# EAGLE design roast-pcb (EAGLE 9.1.3)
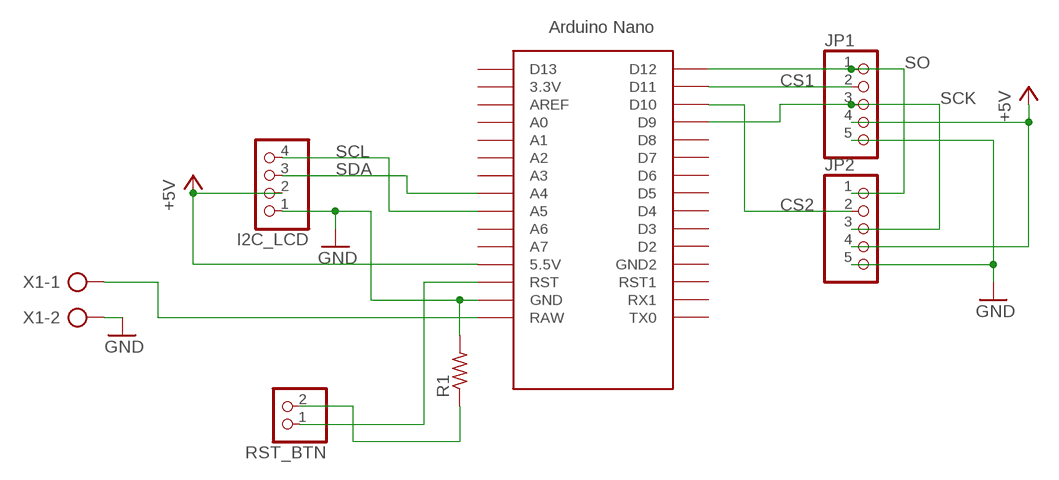
[diagram p0: schematic, sheet 1]

## Parts
I2C_LCD  PINHD-1X4  [1X04]
JP1  PINHD-1X5  [1X05]
JP2  PINHD-1X5  [1X05]
R1  R-US_0207/10  [0207/10]
RST_BTN  PINHD-1X2  [1X02]
U$1  NANO  [NANO]
X1  AK300/2  [AK300/2]

## Nets
+5V: I2C_LCD.2 JP1.4 JP2.4 U$1.5V(5.5V)
CS1: JP1.2 U$1.D11
CS2: JP2.2 U$1.D10
GND: I2C_LCD.1 JP1.5 JP2.5 R1.2 U$1.GND X1.2
N$1: RST_BTN.1 U$1.RST
N$4: U$1.RAW X1.1
N$5: R1.1 RST_BTN.2
SCK: JP1.3 JP2.3 U$1.D9
SCL: I2C_LCD.4 U$1.A5
SDA: I2C_LCD.3 U$1.A4
SO: JP1.1 JP2.1 U$1.D12
Unconnected: U$1.3.3V U$1.A0 U$1.A1 U$1.A2 U$1.A3 U$1.A6 U$1.A7 U$1.AREF U$1.D2 U$1.D3 U$1.D4 U$1.D5 U$1.D6 U$1.D7 U$1.D8 U$1.D13 U$1.GND1(GND2) U$1.ICSP1 U$1.ICSP2 U$1.ICSP3 U$1.ICSP4 U$1.ICSP5 U$1.ICSP6 U$1.RST1 U$1.RX1 U$1.TX0

## Library data of the parts
I2C_LCD = pinhead:PINHD-1X4: PIN HEADER
JP1 JP2 = pinhead:PINHD-1X5: PIN HEADER
R1 = rcl:R-US_: RESISTOR, American symbol; SPICEPREFIX: R
RST_BTN = pinhead:PINHD-1X2: PIN HEADER
U$1 = Arduino-clone:NANO: Arduino Nano
X1 = con-ptr500:AK300/2: CONNECTOR; OC_FARNELL: unknown; OC_NEWARK: unknown

## Board
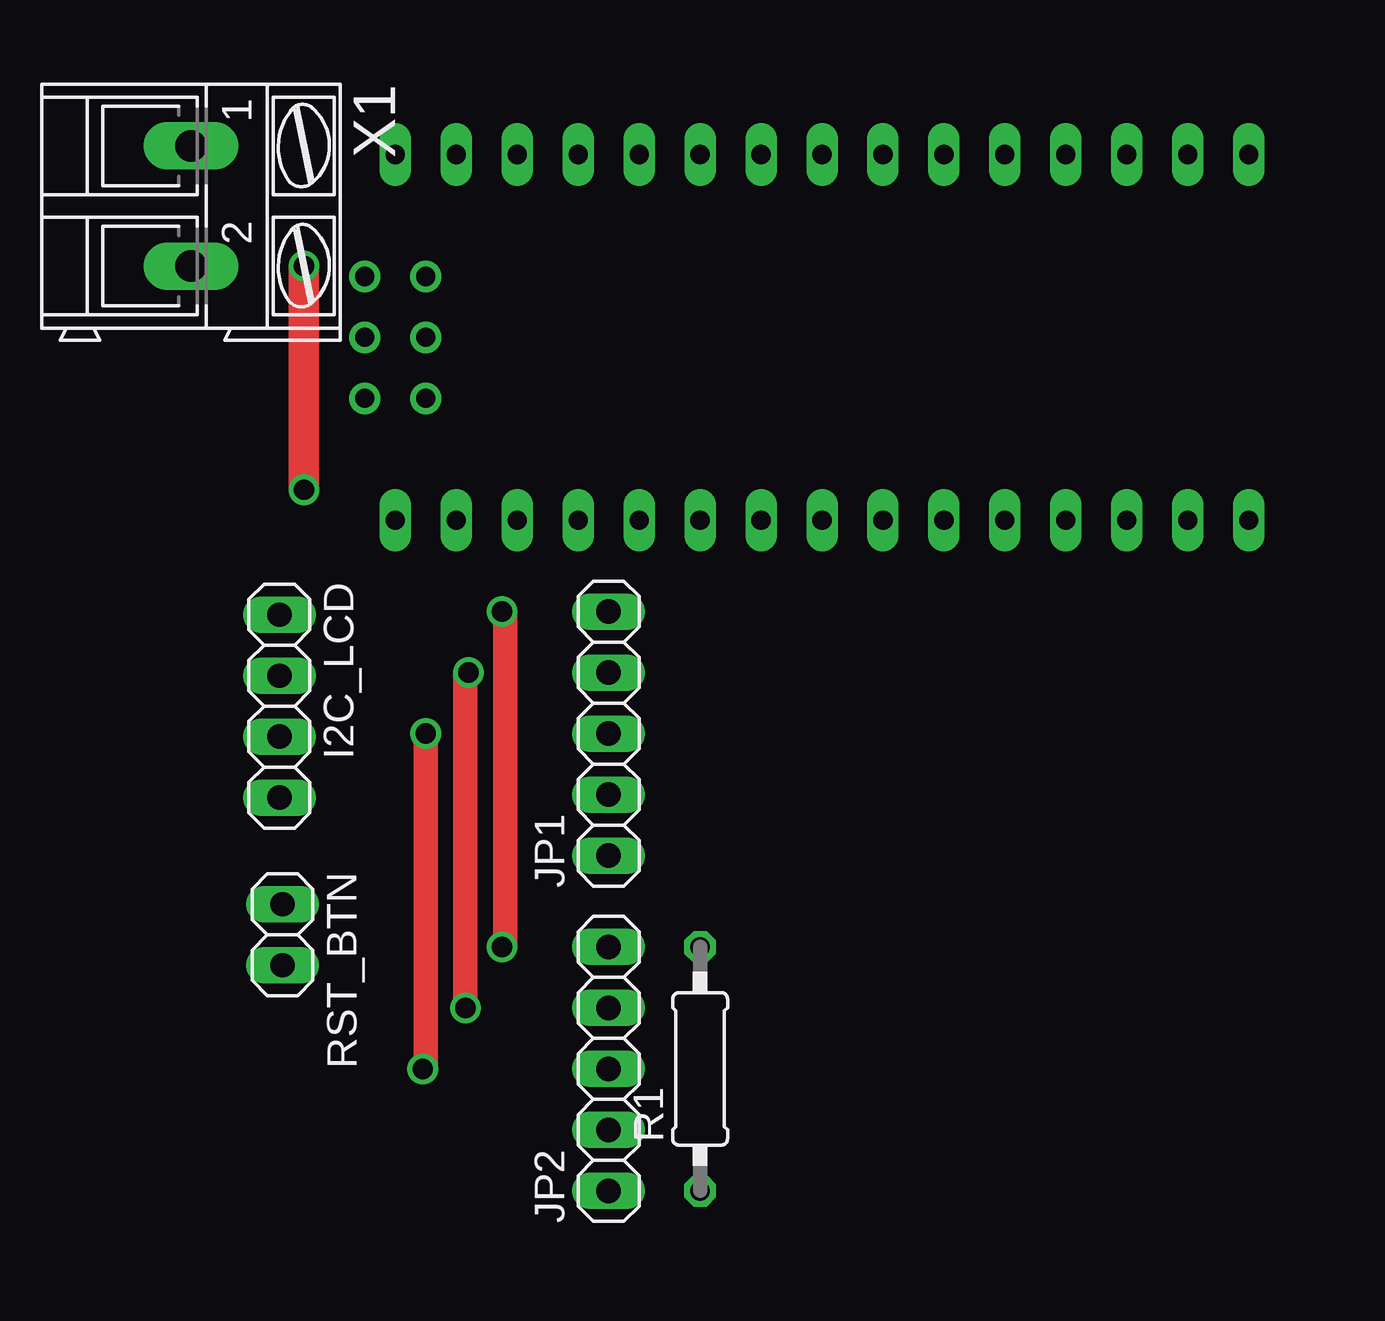
[diagram p1: board, top side]
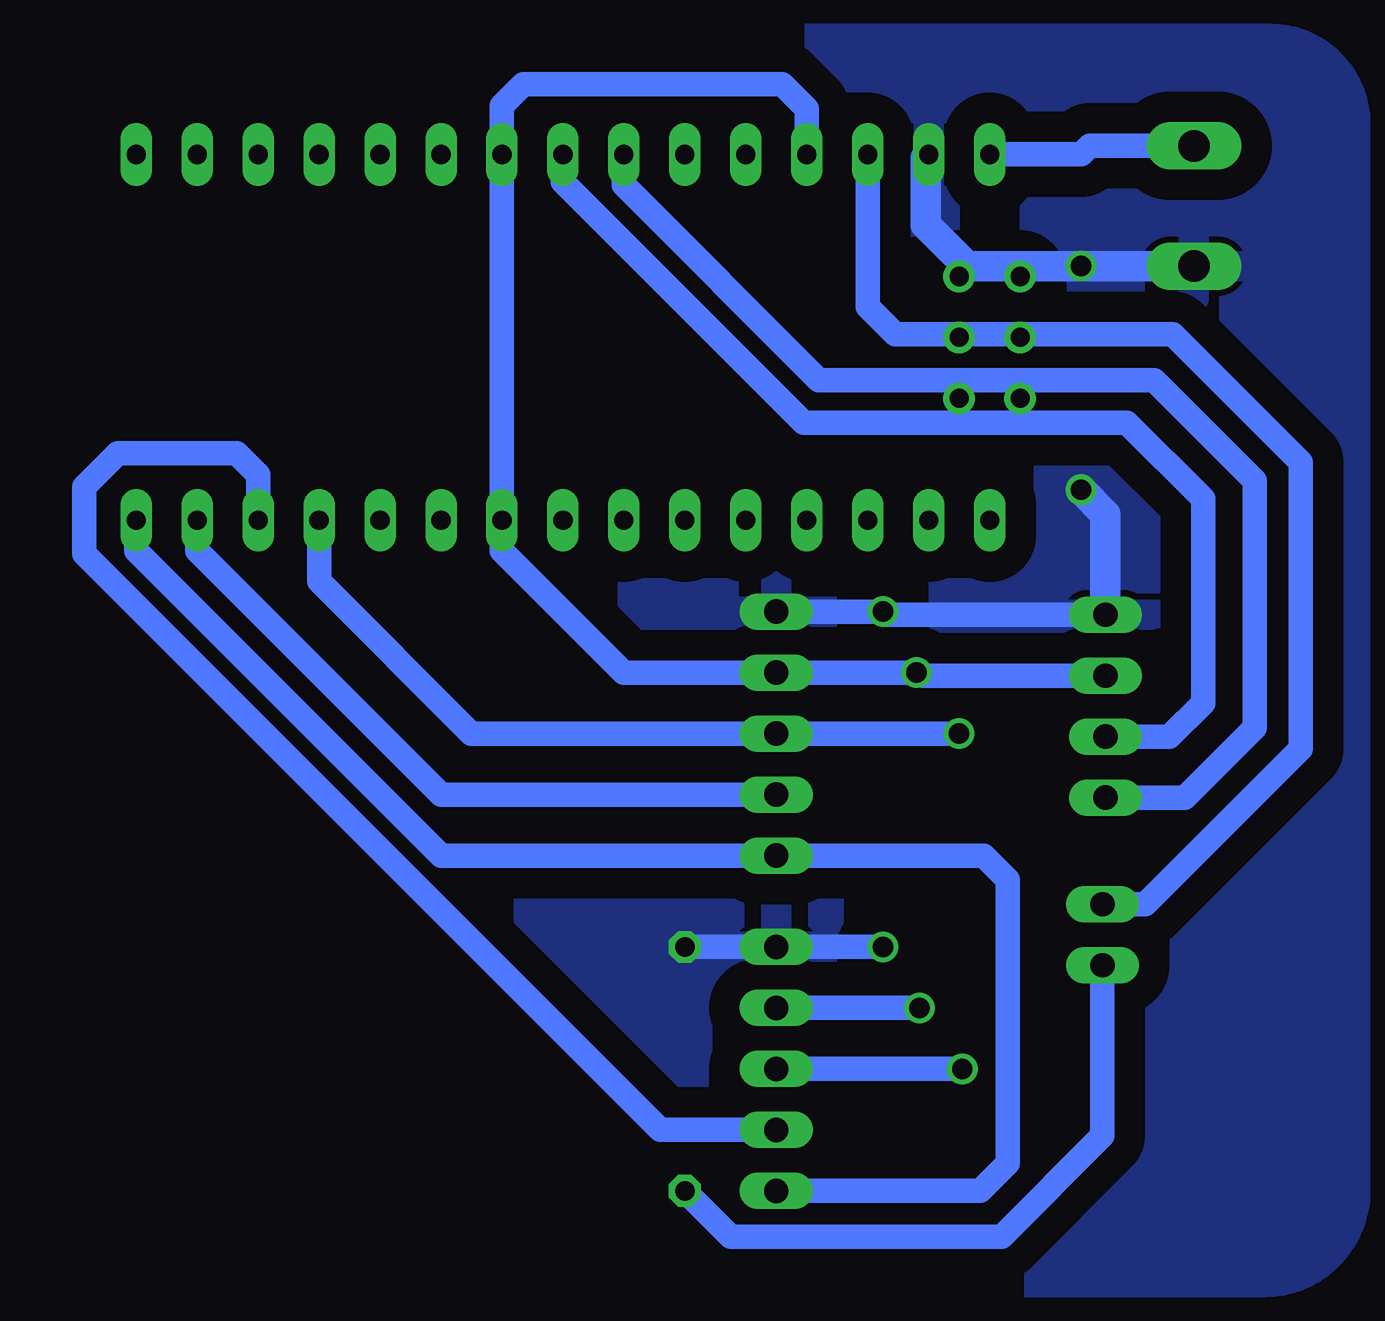
[diagram p2: board, bottom side, seen from below]

No outline drawn. Coordinates in mm, seen from the top.
Copper layers (1*16): Top 0.035mm / dielectric 1.5mm / Bottom 0.035mm
Design rules "default": minimum track width 6mil, minimum drill 0.35mm, track to track 6mil, track to pad 6mil, pad to pad 6mil, via to via 6mil, smd to smd 6mil, copper to edge 40mil, drill to drill 6mil, minimum pad ring 10mil, minimum via ring 8mil, stop-mask expansion 4mil, vias tented up to drill 0mil, thermal gap 10mil

### Footprints (pad centres in the part's own frame; a part is rotated, then mirrored left to right if it is on the bottom)
1X04 = drill 1.016 long: 1 -3.81,0; 2 -1.27,0; 3 1.27,0; 4 3.81,0
1X05 = drill 1.016 long: 1 -5.08,0; 2 -2.54,0; 3 0,0; 4 2.54,0; 5 5.08,0
0207/10 = drill 0.813 octagon: 1 -5.08,0; 2 5.08,0
1X02 = drill 1.016 long: 1 -1.27,0; 2 1.27,0
NANO = drill 0.8 long: 3.3V -10.16,24.13; 5V -10.16,-1.27; A0 -10.16,19.05; A1 -10.16,16.51; A2 -10.16,13.97; A3 -10.16,11.43; A4 -10.16,8.89; A5 -10.16,6.35; A6 -10.16,3.81; A7 -10.16,1.27; AREF -10.16,21.59; D2 5.08,1.27; D3 5.08,3.81; D4 5.08,6.35; D5 5.08,8.89; D6 5.08,11.43; D7 5.08,13.97; D8 5.08,16.51; D9 5.08,19.05; D10 5.08,21.59; D11 5.08,24.13; D12 5.08,26.67; D13 -10.16,26.67; GND -10.16,-6.35; GND1 5.08,-1.27; RAW -10.16,-8.89; RST -10.16,-3.81; RST1 5.08,-3.81; RX1 5.08,-6.35; TX0 5.08,-8.89 | drill 0.8: ICSP1 -5.08,-10.16; ICSP2 -5.08,-7.62; ICSP3 -2.54,-10.16; ICSP4 -2.54,-7.62; ICSP5 0,-10.16; ICSP6 0,-7.62
AK300/2 = drill 1.321 long: 1 -2.515,0; 2 2.489,0

### Placement (x,y rotation side)
I2C_LCD  24.38,20.19 270 top
JP1  38.1,19.05 90 top
JP2  38.1,5.08 90 top
R1  41.91,5.08 90 top
RST_BTN  24.51,10.67 270 top
U$1  38.1,33.02 270 top
X1  20.7,41.02 270 top

### Tracks (layer width: path | path; a pad name or v marks a point on that pad's centre or on a via)
+5V  (via drill 0.35, 0.85)
  Top 1.016: v32.13,7.62 v32.13,21.59
  Bottom 1.016: JP2.4 v32.13,7.62 | I2C_LCD.2 32,21.46 v32.13,21.59 v32.26,21.59 JP1.4 44.45,21.59 49.53,26.67 49.53,45.21 48.64,46.1 37.85,46.1 36.83,45.09 U$1.5V
CS1
  Bottom 1.016: JP1.2 48.26,16.51 52.07,16.51 62.23,26.67 U$1.D11
CS2
  Bottom 1.016: JP2.2 42.93,2.54 66.93,26.54 66.93,29.34 65.53,30.73 60.58,30.73 59.69,29.84 U$1.D10
GND  (via drill 0.35, 0.85)
  Top 1.016: v33.78,10.16 v33.78,24.13
  Top 1.27: v25.4,29.21 v25.4,38.53
  Bottom 1.016: v33.78,10.16 JP2.5 R1.2 | JP1.5 v33.78,24.13 33.66,24 I2C_LCD.1
  Bottom 1.27: X1.2 v25.4,38.53 30.15,38.53 31.88,40.26 31.88,43.05 U$1.GND | I2C_LCD.1 24.38,28.19 v25.4,29.21
  pour Bottom (isolate 1.27): 13.97,44.45 arc-90 17.53,48.01 65.41,48.01 arc-90 68.45,44.96 68.45,-0.13 arc-90 64.77,-3.81 17.78,-3.81 arc-90 13.97,0
N$1
  Bottom 1.016: RST_BTN.1 22.73,11.94 16.26,18.41 16.26,30.35 21.59,35.69 33.15,35.69 34.29,36.83 U$1.RST
N$2  (via drill 0.85)
  other vias: 33.66,10.16
N$3  (via drill 0.85)
  other vias: 33.66,24.13
N$4
  Bottom 1.016: X1.1 25.04,43.54 25.4,43.18 U$1.RAW
N$5
  Bottom 1.016: RST_BTN.2 24.51,2.29 28.7,-1.91 40.01,-1.91 R1.1
SCK  (via drill 0.35, 0.85)
  Top 1.016: v30.48,5.08 v30.48,19.05
  Bottom 1.016: JP2.3 v30.48,5.08 v30.35,5.08 | v30.48,19.05 JP1.3 46.99,19.05 50.8,19.05 57.15,25.4 U$1.D9
SCL
  Bottom 1.016: I2C_LCD.4 21.08,16.38 18.16,19.3 18.16,29.59 22.35,33.78 36.32,33.78 44.45,41.91 U$1.A5
SDA
  Bottom 1.016: I2C_LCD.3 21.72,18.92 20.32,20.32 20.32,28.83 23.5,32 36.96,32 46.99,42.04 U$1.A4
SO
  Bottom 1.016: JP2.1 29.59,0 28.45,1.14 28.45,12.95 29.46,13.97 JP1.1 49.53,13.97 52.07,13.97 64.77,26.67 U$1.D12